# EAGLE design D1 - No LCD (EAGLE 9.5.2)
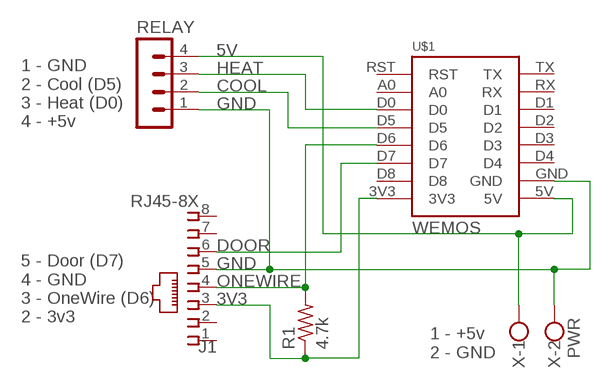
[diagram p0: schematic, sheet 1]

## Parts
J1  RJ45-8X  [RJ45-NO-SHIELD]
R1  4.7k  R-US_0309/12  [0309/12]
RELAY  MA04-1  [MA04-1]
U$1  WEMOS  [WEMOS]
X  PWR  W237-102  [W237-102]

## Nets
3V3 [3v]: J1.3 R1.1 U$1.3V3
5V [5v]: RELAY.4 U$1.5V X.1
COOL: RELAY.2 U$1.D5
DOOR: J1.6 U$1.D7
GND [Gnd]: J1.5 RELAY.1 U$1.GND X.2
HEAT: RELAY.3 U$1.D0
ONEWIRE: J1.4 R1.2 U$1.D6
Unconnected: J1.1 J1.2 J1.7 J1.8 U$1.A0 U$1.D1 U$1.D2 U$1.D3 U$1.D4 U$1.D8 U$1.RST U$1.RX U$1.TX

## Notes on the sheet
- 1 - GND
  2 - Cool (D5)
  3 - Heat (D0)
  4 - +5v
- 5 - Door (D7)
  4 - GND
  3 - OneWire (D6) 
  2 - 3v3
- 1 - +5v
  2 - GND

## Library data of the parts
J1 = con-tycoelectronics:RJ45: CORCOM Modular RJ Jacks No Shield Source: www.tycoelectronics.com .. ENG_DS_1654001_1099_RJ_L_0507.pdf; MPN: RJ45-8X; OC_FARNELL: unknown; OC_NEWARK: 16R6101
R1 = rcl:R-US_: RESISTOR, American symbol; SPICEPREFIX: R
RELAY = con-lstb:MA04-1: PIN HEADER; OC_FARNELL: unknown; OC_NEWARK: unknown
U$1 = 1455413453956-wemos:WEMOS
X = con-wago-500:W237-102: WAGO SCREW CLAMP; MPN: 237-102; OC_FARNELL: unknown; OC_NEWARK: 70K9898

## Net classes
0 default: width 0.305 mm, clearance 0.305 mm
1 5v: width 0.406 mm, clearance 0.406 mm
2 3v: width 0.406 mm, clearance 0.406 mm
3 Gnd: width 0.406 mm, clearance 0.406 mm

## Board
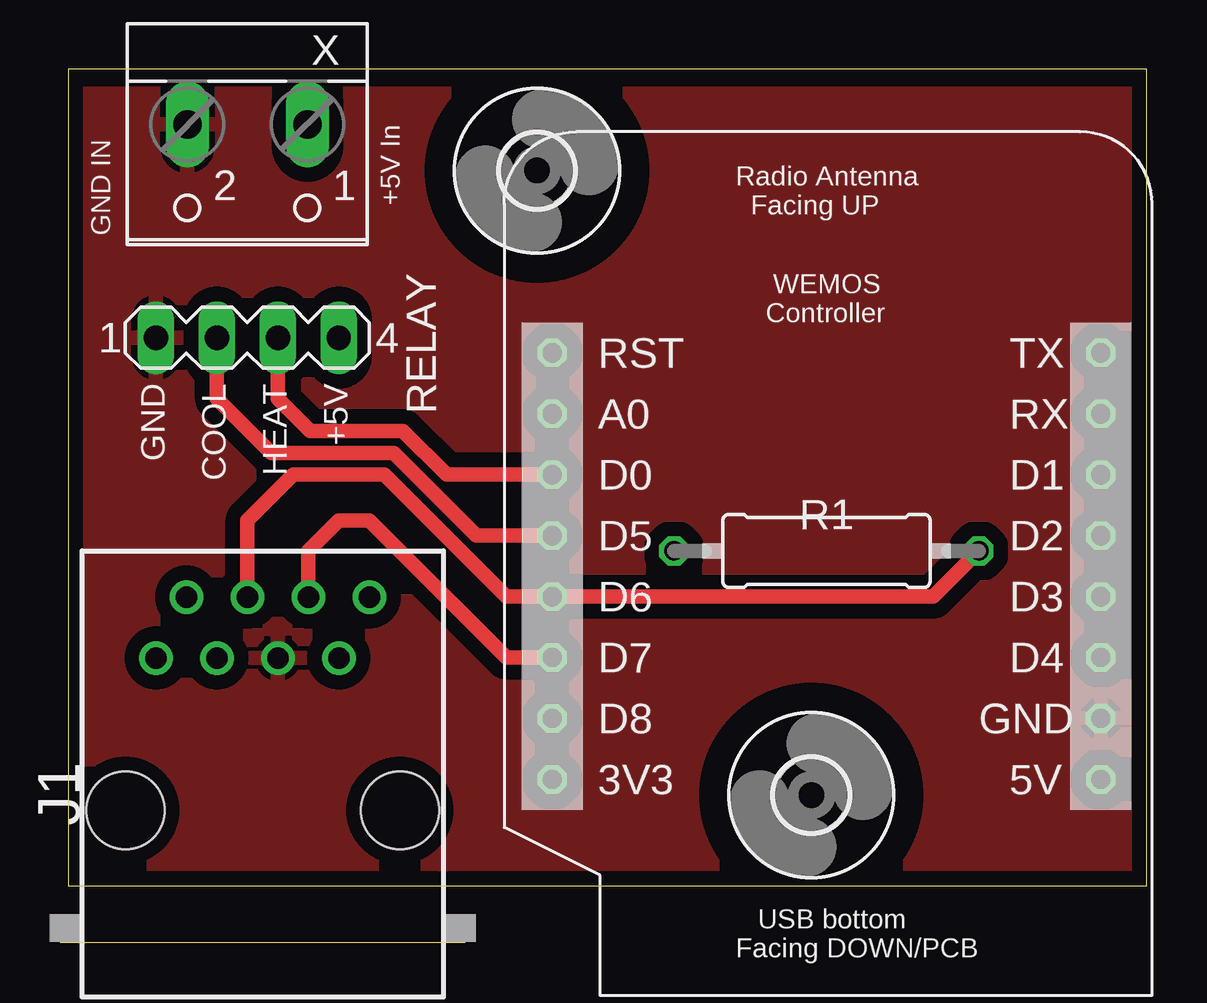
[diagram p1: board, top side]
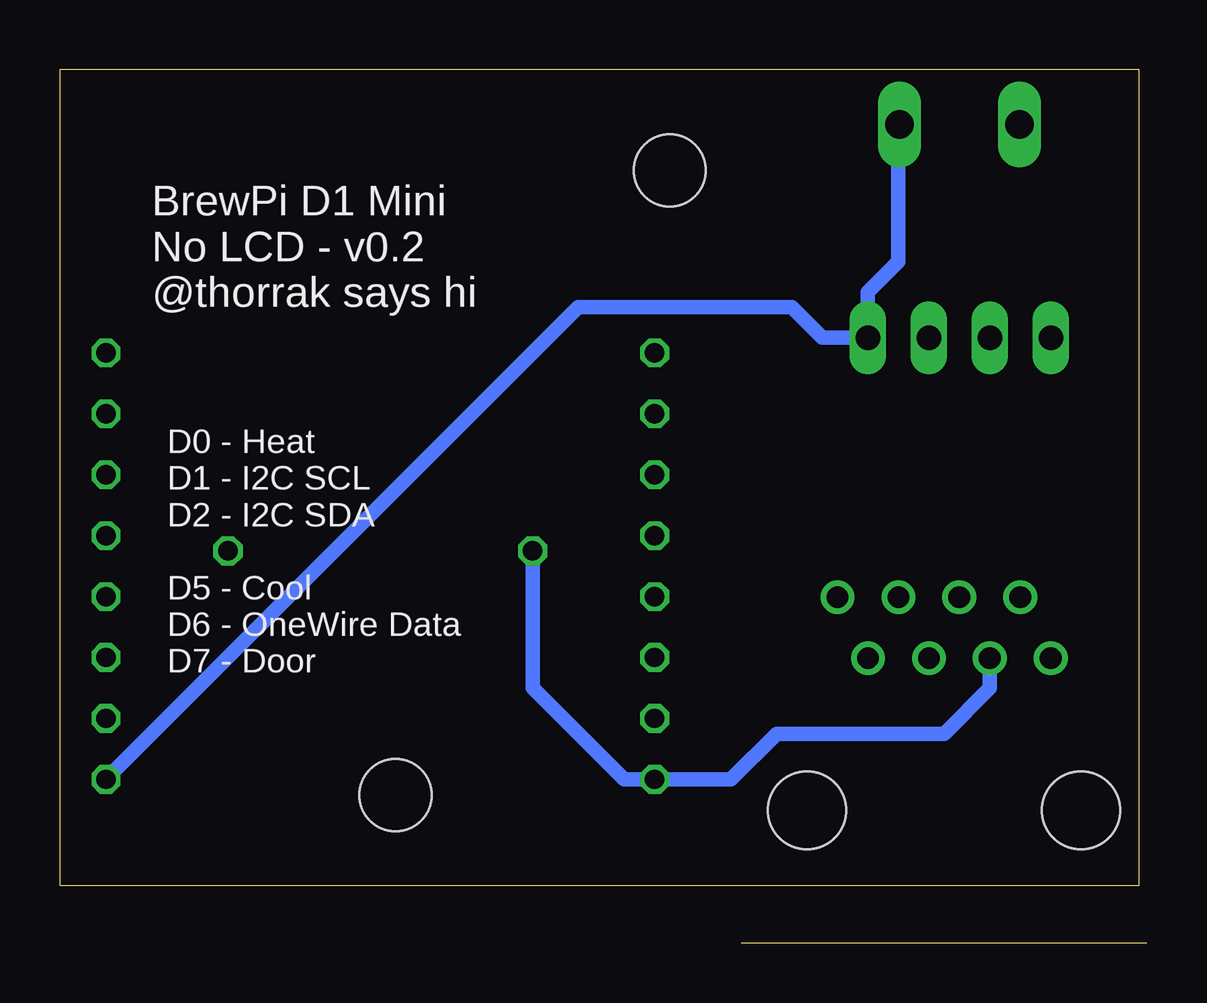
[diagram p2: board, bottom side, seen from below]

Size 44.95 x 34.05 mm. Coordinates in mm from the lower left corner, seen from the top.
Outline: 44.95,0 44.95,34.05 0,34.05 0,0 44.95,0
Copper layers (1*16): Top 0.0356mm / dielectric 1.5011mm / Bottom 0.0356mm
Design rules "PCBs_io": minimum track width 6mil, minimum drill 13mil, track to track 6mil, track to pad 6mil, pad to pad 6mil, via to via 6mil, smd to smd 6mil, copper to edge 15mil, drill to drill 6mil, minimum pad ring 7mil, minimum via ring 7mil, stop-mask expansion 3mil, vias tented up to drill 0mil, thermal gap 10mil

### Footprints (pad centres in the part's own frame; a part is rotated, then mirrored left to right if it is on the bottom)
RJ45-NO-SHIELD = drill 0.9 pad 1.4: 1 -4.445,6.35; 2 -3.175,8.89; 3 -1.905,6.35; 4 -0.635,8.89; 5 0.635,6.35; 6 1.905,8.89; 7 3.175,6.35; 8 4.445,8.89 | hole 3.251: -5.715,0; 5.715,0
0309/12 = drill 0.813 octagon: 1 -6.35,0; 2 6.35,0
MA04-1 = drill 1.016 long: 1 -3.81,0; 2 -1.27,0; 3 1.27,0; 4 3.81,0
WEMOS = drill 0.8 octagon: 3V3 0,0; 5V 22.86,0; A0 0,15.24; D0 0,12.7; D1 22.86,12.7; D2 22.86,10.16; D3 22.86,7.62; D4 22.86,5.08; D5 0,10.16; D6 0,7.62; D7 0,5.08; D8 0,2.54; GND 22.86,2.54; RST 0,17.78; RX 22.86,15.24; TX 22.86,17.78
3,0 = hole 3: 0,0
W237-102 = drill 1.194 long: 1 -2.5,-1.27; 2 2.5,-1.27

### Placement (x,y rotation side)
J1  8.11,3.15 0 top
R1  31.6,13.97 0 top
RELAY  7.47,22.86 0 top
U$1  20.17,4.45 0 top
U$4  [3,0]  30.97,3.79 0 top
U$5  [3,0]  19.54,29.82 0 top
X  7.47,30.48 180 top

### Tracks (layer width: path | path; a pad name or v marks a point on that pad's centre or on a via)
3V3
  Bottom 0.61: J1.3 6.21,8.25 8.11,6.35 15.09,6.35 17,4.45 U$1.3V3 21.44,4.45 25.25,8.26 R1.1
5V
  Bottom 0.61: U$1.5V 23.35,24.13 14.46,24.13 13.19,22.86 RELAY.4 11.28,24.77 10.01,26.04 10.01,31.71 X.1
COOL
  Top 0.61: U$1.D5 17.02,14.61 13.56,18.06 8.46,18.06 6.2,20.32 RELAY.2
DOOR
  Top 0.61: J1.6 10.01,13.97 11.28,15.24 12.55,15.24 15.09,12.7 18.27,9.53 U$1.D7
GND
  pour Top (isolate 0.61): 0.1,33.02 44.94,33.02 44.94,0 0.1,0
HEAT
  Top 0.61: U$1.D0 15.77,17.14 13.94,18.97 10.09,18.97 8.74,20.32 RELAY.3
ONEWIRE
  Top 0.61: J1.4 7.47,15.24 9.38,17.14 13.19,17.14 18.27,12.06 U$1.D6 36.05,12.06 R1.2

### Text on the board
tPlace: +5V In | GND IN | GND | COOL | HEAT | +5V
bNames: BrewPi D1 Mini / No LCD - v0.2 / @thorrak says hi | D0 - Heat / D1 - I2C SCL / D2 - I2C SDA / / D5 - Cool / D6 - OneWire Data / D7 - Door